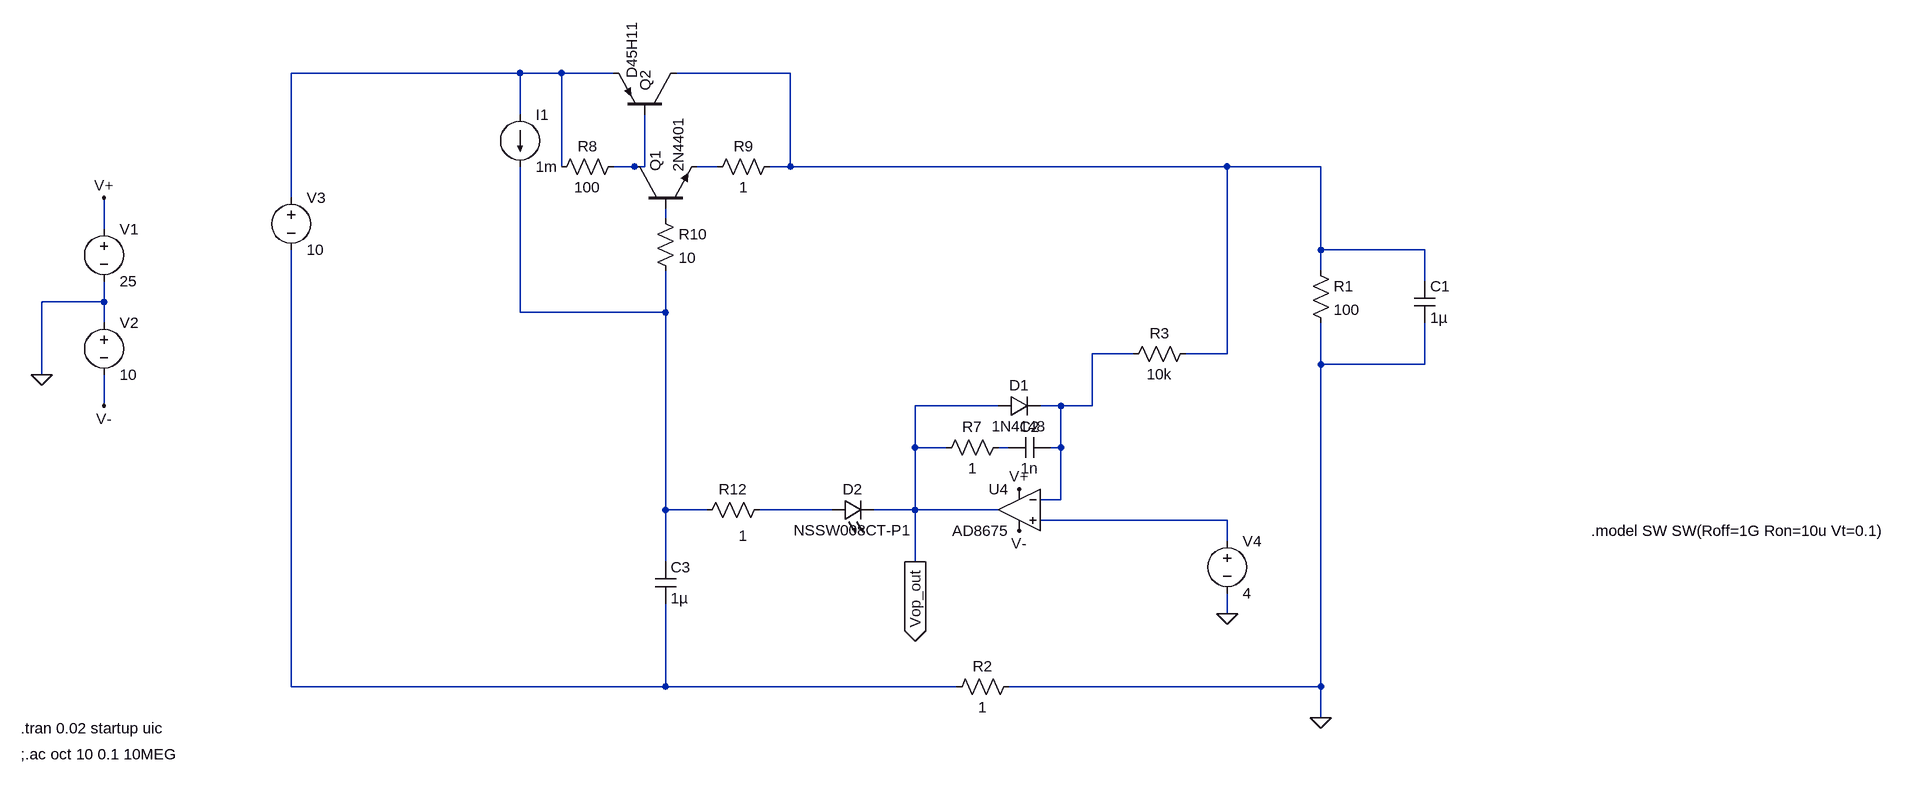
[diagram p0: schematic blackdog_experiments_check_switchover_voltages.asc]
blackdog_experiments_check_switchover_voltages.asc, the LTspice schematic file:
Version 4
SHEET 1 2384 1220
WIRE 32 -272 -320 -272
WIRE 96 -272 32 -272
WIRE 176 -272 96 -272
WIRE 448 -272 272 -272
WIRE 32 -208 32 -272
WIRE 96 -128 96 -272
WIRE 208 -128 176 -128
WIRE 224 -128 224 -208
WIRE 224 -128 208 -128
WIRE 336 -128 304 -128
WIRE 448 -128 448 -272
WIRE 448 -128 416 -128
WIRE 1120 -128 448 -128
WIRE 1264 -128 1120 -128
WIRE -320 -80 -320 -272
WIRE 256 -48 256 -64
WIRE -608 -32 -608 -80
WIRE 1264 0 1264 -128
WIRE 1424 0 1264 0
WIRE 1264 32 1264 0
WIRE 1424 48 1424 0
WIRE -608 80 -608 48
WIRE -608 80 -704 80
WIRE 32 96 32 -128
WIRE 256 96 256 32
WIRE 256 96 32 96
WIRE -608 112 -608 80
WIRE 976 160 912 160
WIRE 1120 160 1120 -128
WIRE 1120 160 1056 160
WIRE 1264 176 1264 112
WIRE 1424 176 1424 112
WIRE 1424 176 1264 176
WIRE -704 192 -704 80
WIRE -608 240 -608 192
WIRE 768 240 640 240
WIRE 864 240 832 240
WIRE 912 240 912 160
WIRE 912 240 864 240
WIRE 640 304 640 240
WIRE 688 304 640 304
WIRE 784 304 768 304
WIRE 864 304 864 240
WIRE 864 304 848 304
WIRE 864 384 864 304
WIRE 864 384 832 384
WIRE 256 400 256 96
WIRE 320 400 256 400
WIRE 512 400 400 400
WIRE 640 400 640 304
WIRE 640 400 576 400
WIRE 768 400 640 400
WIRE 1120 416 832 416
WIRE 1120 448 1120 416
WIRE 256 480 256 400
WIRE 640 480 640 400
WIRE 1120 560 1120 528
WIRE -320 672 -320 0
WIRE 256 672 256 544
WIRE 256 672 -320 672
WIRE 704 672 256 672
WIRE 1264 672 1264 176
WIRE 1264 672 784 672
WIRE 1264 720 1264 672
FLAG -608 -80 V+
FLAG -608 240 V-
FLAG 1264 720 0
FLAG 800 368 V+
FLAG 800 432 V-
FLAG 640 480 Vop_out
IOPIN 640 480 Out
FLAG 1120 560 0
FLAG -704 192 0
SYMBOL voltage -608 -48 R0
WINDOW 123 0 0 Left 0
WINDOW 39 0 0 Left 0
SYMATTR InstName V1
SYMATTR Value 25
SYMBOL voltage -608 96 R0
WINDOW 123 0 0 Left 0
WINDOW 39 0 0 Left 0
SYMATTR InstName V2
SYMATTR Value 10
SYMBOL npn 208 -64 R270
SYMATTR InstName Q1
SYMATTR Value 2N4401
SYMBOL voltage -320 -96 R0
WINDOW 123 0 0 Left 0
WINDOW 39 0 0 Left 0
SYMATTR InstName V3
SYMATTR Value 10
SYMBOL LED 512 416 R270
WINDOW 0 32 32 VTop 2
WINDOW 3 0 32 VBottom 2
SYMATTR InstName D2
SYMATTR Value NSSW008CT-P1
SYMATTR Description Diode
SYMATTR Type diode
SYMBOL res 1248 16 R0
SYMATTR InstName R1
SYMATTR Value 100
SYMBOL pnp 272 -208 M270
WINDOW 0 36 47 Left 2
SYMATTR InstName Q2
SYMATTR Value D45H11
SYMBOL res 192 -144 R90
WINDOW 0 0 56 VBottom 2
WINDOW 3 32 56 VTop 2
SYMATTR InstName R8
SYMATTR Value 100
SYMBOL res 432 -144 R90
WINDOW 0 0 56 VBottom 2
WINDOW 3 32 56 VTop 2
SYMATTR InstName R9
SYMATTR Value 1
SYMBOL res 240 -64 R0
SYMATTR InstName R10
SYMATTR Value 10
SYMBOL res 416 384 R90
WINDOW 0 0 56 VBottom 2
WINDOW 3 40 41 VTop 2
SYMATTR InstName R12
SYMATTR Value 1
SYMBOL Opamps\\AD8675 800 336 M0
SYMATTR InstName U4
SYMBOL res 784 288 R90
WINDOW 0 0 56 VBottom 2
WINDOW 3 32 56 VTop 2
SYMATTR InstName R7
SYMATTR Value 1
SYMBOL cap 848 288 R90
WINDOW 0 0 32 VBottom 2
WINDOW 3 32 32 VTop 2
SYMATTR InstName C2
SYMATTR Value 1n
SYMBOL voltage 1120 432 R0
WINDOW 123 0 0 Left 0
WINDOW 39 0 0 Left 0
SYMATTR InstName V4
SYMATTR Value 4
SYMBOL cap 1408 48 R0
SYMATTR InstName C1
SYMATTR Value 1µ
SYMBOL res 1072 144 R90
WINDOW 0 0 56 VBottom 2
WINDOW 3 32 56 VTop 2
SYMATTR InstName R3
SYMATTR Value 10k
SYMBOL current 32 -208 R0
WINDOW 123 0 0 Left 0
WINDOW 39 0 0 Left 0
SYMATTR InstName I1
SYMATTR Value 1m
SYMBOL cap 240 480 R0
SYMATTR InstName C3
SYMATTR Value 1µ
SYMBOL diode 768 256 R270
WINDOW 0 32 32 VTop 2
WINDOW 3 0 32 VBottom 2
SYMATTR InstName D1
SYMATTR Value 1N4148
SYMBOL res 800 656 R90
WINDOW 0 0 56 VBottom 2
WINDOW 3 32 56 VTop 2
SYMATTR InstName R2
SYMATTR Value 1
TEXT -736 736 Left 2 !.tran 0.02 startup uic
TEXT -736 776 Left 2 !;.ac oct 10 0.1 10MEG
TEXT 1680 432 Left 2 !.model SW SW(Roff=1G Ron=10u Vt=0.1)

The netlist it stands for:
* blackdog_experiments_check_switchover_voltages.asc
V1 V+ 0 25
V2 0 V- 10
Q1 N003 N005 N004 0 2N4401
V3 N001 N011 10
D2 N009 Vop_out NSSW008CT-P1
R1 N002 0 100
Q2 N002 N003 N001 0 D45H11
R8 N003 N001 100
R9 N002 N004 1
R10 N005 N006 10
R12 N009 N006 1
XU4 N010 N007 V+ V- Vop_out AD8675  ; pins In+ In- V+ V- OUT
R7 N008 Vop_out 1
C2 N007 N008 1n
V4 N010 0 4
C1 N002 0 1µ
R3 N002 N007 10k
I1 N001 N006 1m
C3 N006 N011 1µ
D1 Vop_out N007 1N4148
R2 0 N011 1
.model D D
.lib standard.dio
.model NPN NPN
.model PNP PNP
.lib standard.bjt
.tran 0.02 startup uic
;.ac oct 10 0.1 10MEG
.model SW SW(Roff=1G Ron=10u Vt=0.1)
.backanno
.end